# EAGLE design qo-100-i2c-buffer (EAGLE 9.6.2)
CNAME: None; CREVISION: 1; DESIGNER: Joao Silva

## Sheet 1 of 3: MCU
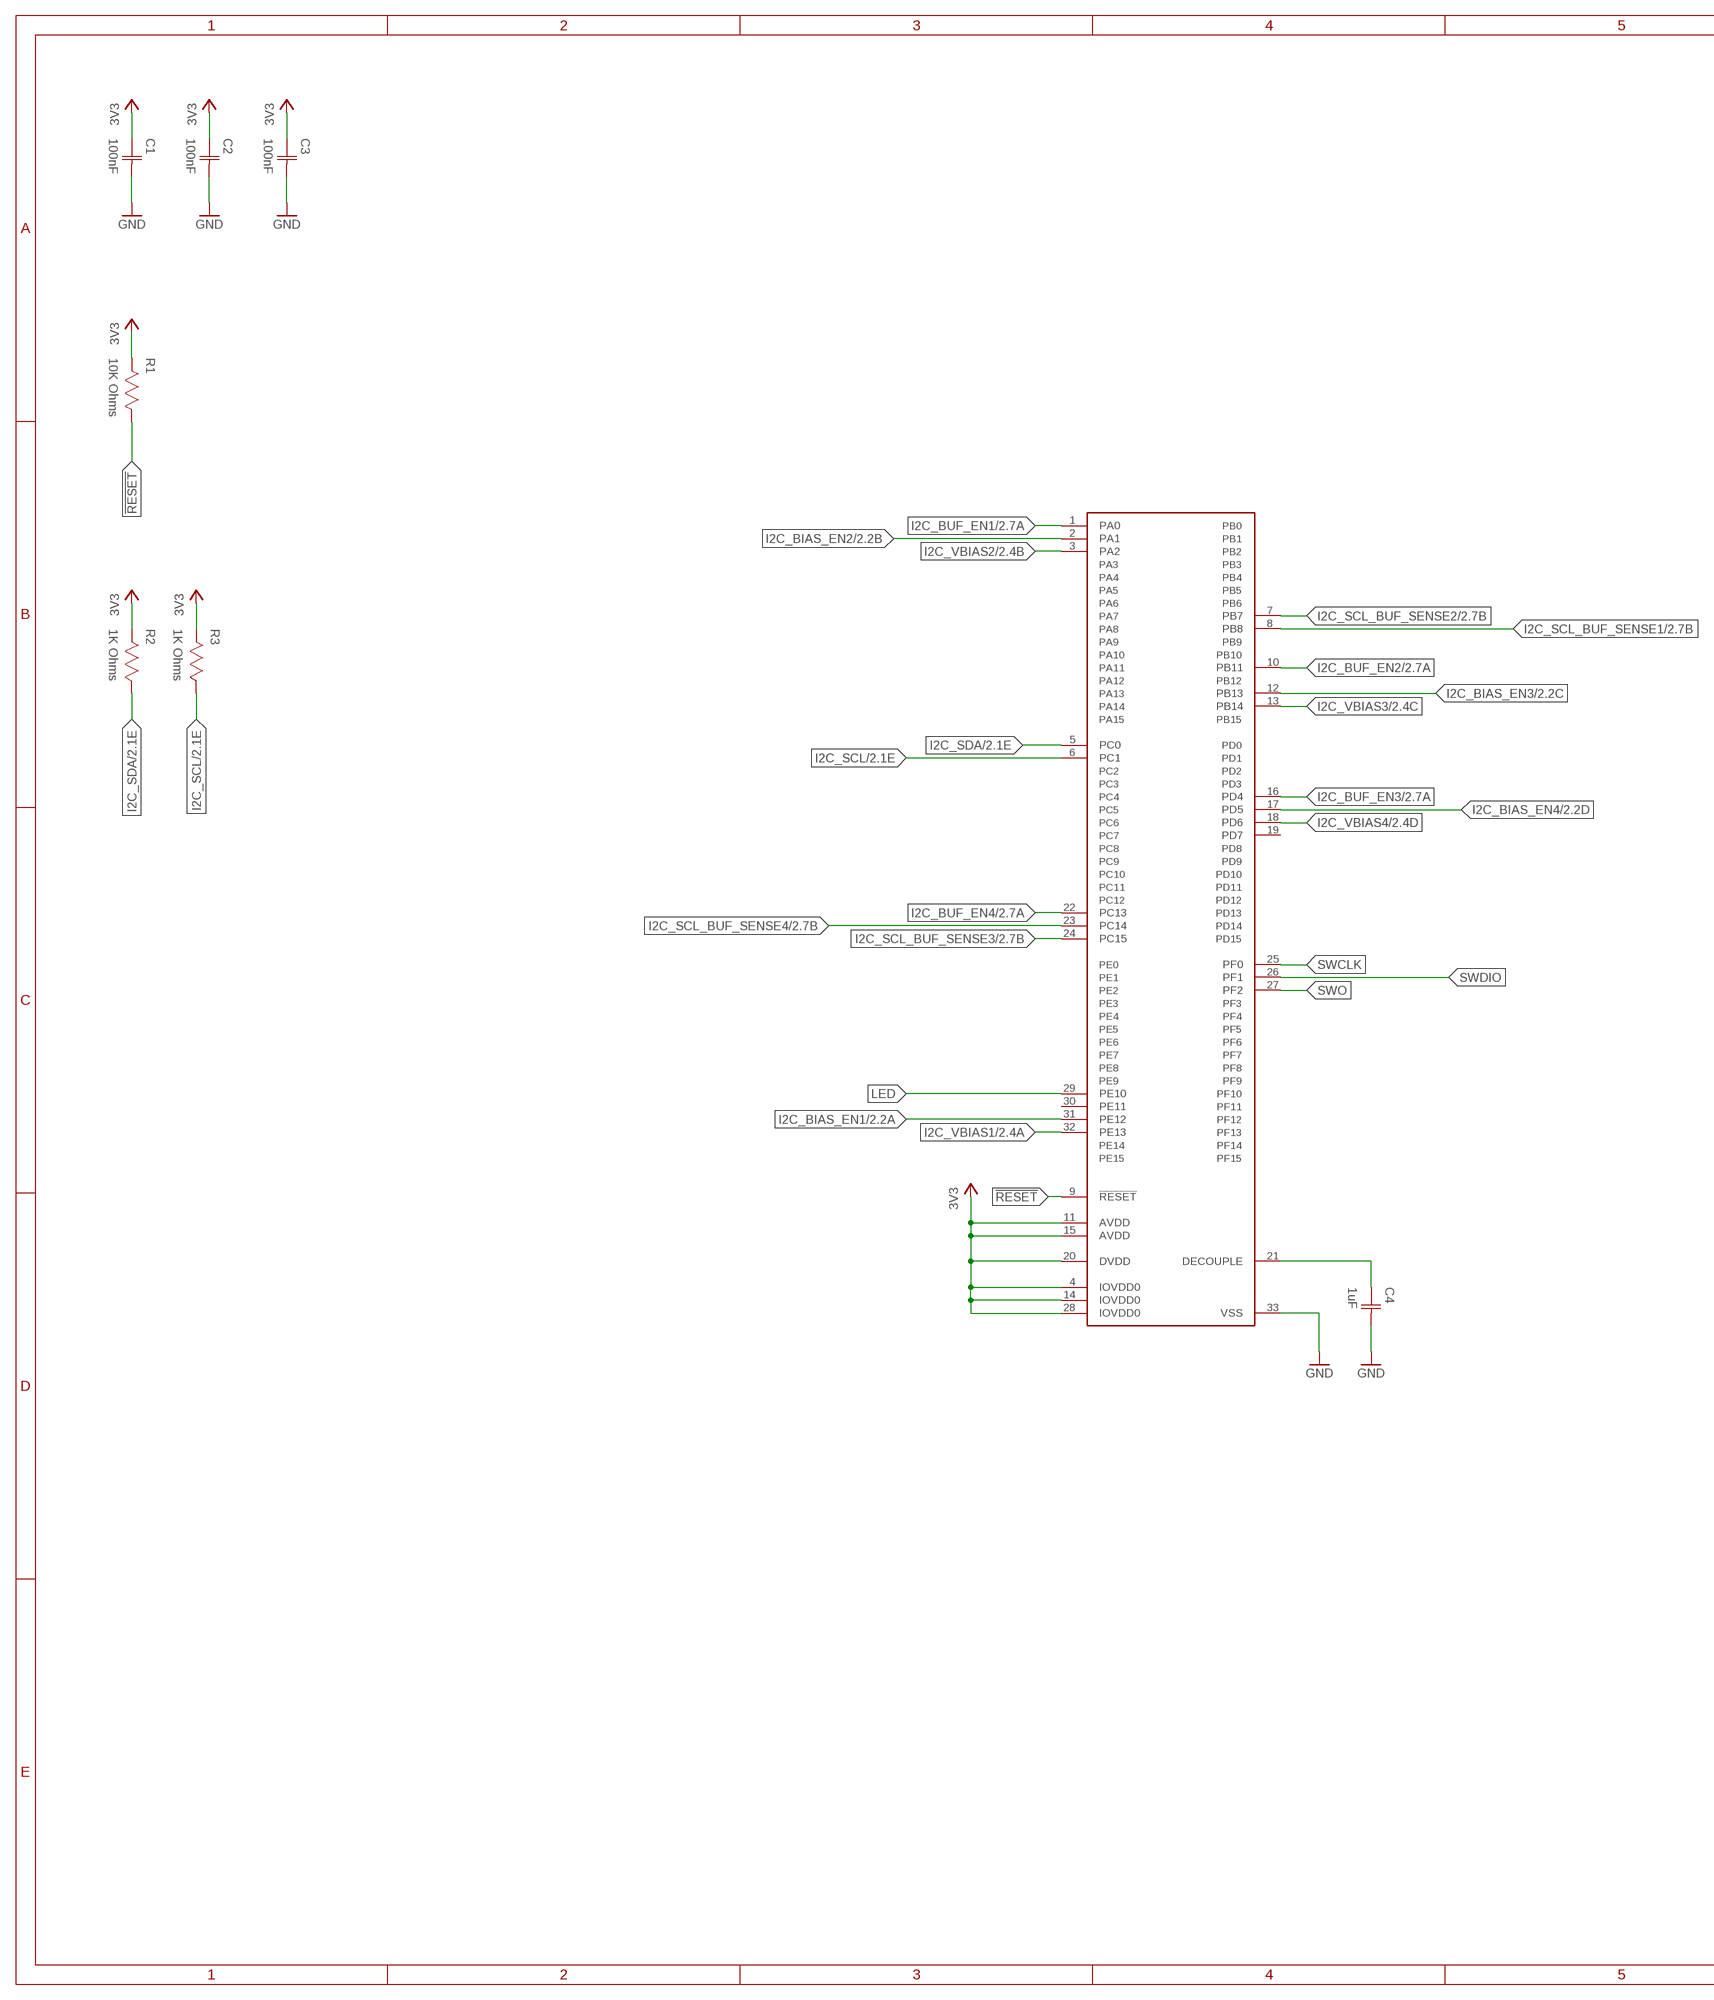
[diagram p0: schematic, sheet 1, part 1 of 2]
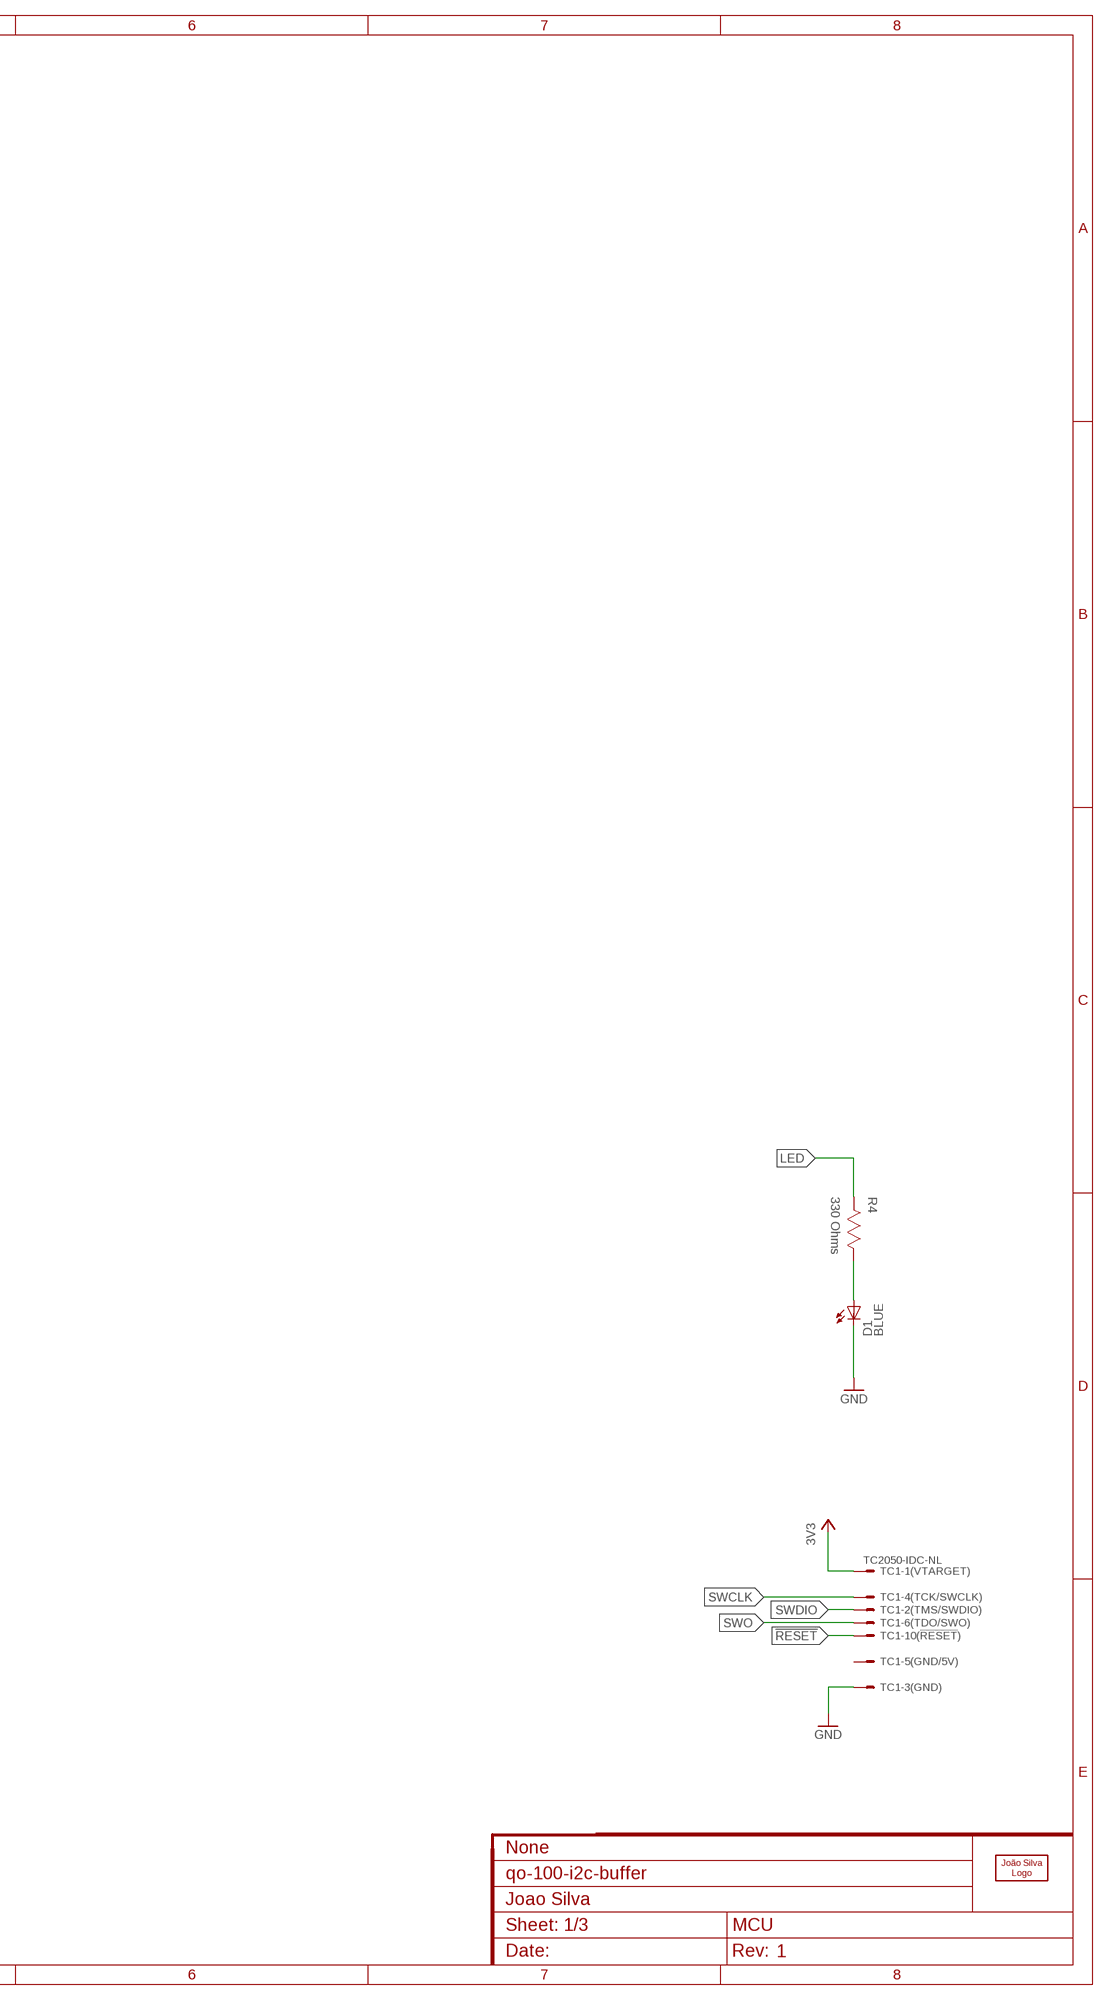
[diagram p1: schematic, sheet 1, part 2 of 2]

### Parts
C1  100nF  CAPACITOR-0402  [CAP0402]
C2  100nF  CAPACITOR-0402  [CAP0402]
C3  100nF  CAPACITOR-0402  [CAP0402]
C4  1uF  CAPACITOR-0402  [CAP0402]
D1  LED0603  [0603]
LOGO1  JS-5MM  [JS_5MM]
R1  10K Ohms  RESISTOR-0402  [RES0402]
R2  1K Ohms  RESISTOR-0402  [RES0402]
R3  1K Ohms  RESISTOR-0402  [RES0402]
R4  330 Ohms  RESISTOR-0402  [RES0402]
TC1  TC2050-IDC-NL  [TC2050-IDC-NL]
U1  EFM32TG11B120F128GM32  [QFN32_0.5P_TG]

### Nets
3V3: C1.1(C1) C2.1(C1) C3.1(C1) R1.2 R2.2 R3.2 TC1.1 U1.4(IOVDD0) U1.11(AVDD) U1.14(IOVDD0) U1.15(AVDD) U1.20(DVDD) U1.28(IOVDD0) ; also sheet 2,3
!RESET: R1.1 TC1.10 U1.9(!RESET)
GND: C1.2(C2) C2.2(C2) C3.2(C2) C4.2(C2) D1.C TC1.3 U1.33(VSS) ; also sheet 2,3
I2C_BIAS_EN1: U1.31(PE12) ; also sheet 2
I2C_BIAS_EN2: U1.2(PA1) ; also sheet 2
I2C_BIAS_EN3: U1.12(PB13) ; also sheet 2
I2C_BIAS_EN4: U1.17(PD5) ; also sheet 2
I2C_BUF_EN1: U1.1(PA0) ; also sheet 2
I2C_BUF_EN2: U1.10(PB11) ; also sheet 2
I2C_BUF_EN3: U1.16(PD4) ; also sheet 2
I2C_BUF_EN4: U1.22(PC13) ; also sheet 2
I2C_SCL: R3.1 U1.6(PC1) ; also sheet 2,3
I2C_SCL_BUF_SENSE1: U1.8(PB8) ; also sheet 2
I2C_SCL_BUF_SENSE2: U1.7(PB7) ; also sheet 2
I2C_SCL_BUF_SENSE3: U1.24(PC15) ; also sheet 2
I2C_SCL_BUF_SENSE4: U1.23(PC14) ; also sheet 2
I2C_SDA: R2.1 U1.5(PC0) ; also sheet 2,3
I2C_VBIAS1: U1.32(PE13) ; also sheet 2
I2C_VBIAS2: U1.3(PA2) ; also sheet 2
I2C_VBIAS3: U1.13(PB14) ; also sheet 2
I2C_VBIAS4: U1.18(PD6) ; also sheet 2
LED: R4.2 U1.29(PE10)
N$14: C4.1(C1) U1.21(DECOUPLE)
N$15: D1.A R4.1
SWCLK: TC1.4 U1.25(PF0)
SWDIO: TC1.2 U1.26(PF1)
SWO: TC1.6 U1.27(PF2)
Unconnected: TC1.5 TC1.7 TC1.8 TC1.9 U1.19(PD7) U1.30(PE11)

## Sheet 2 of 3: Isolators
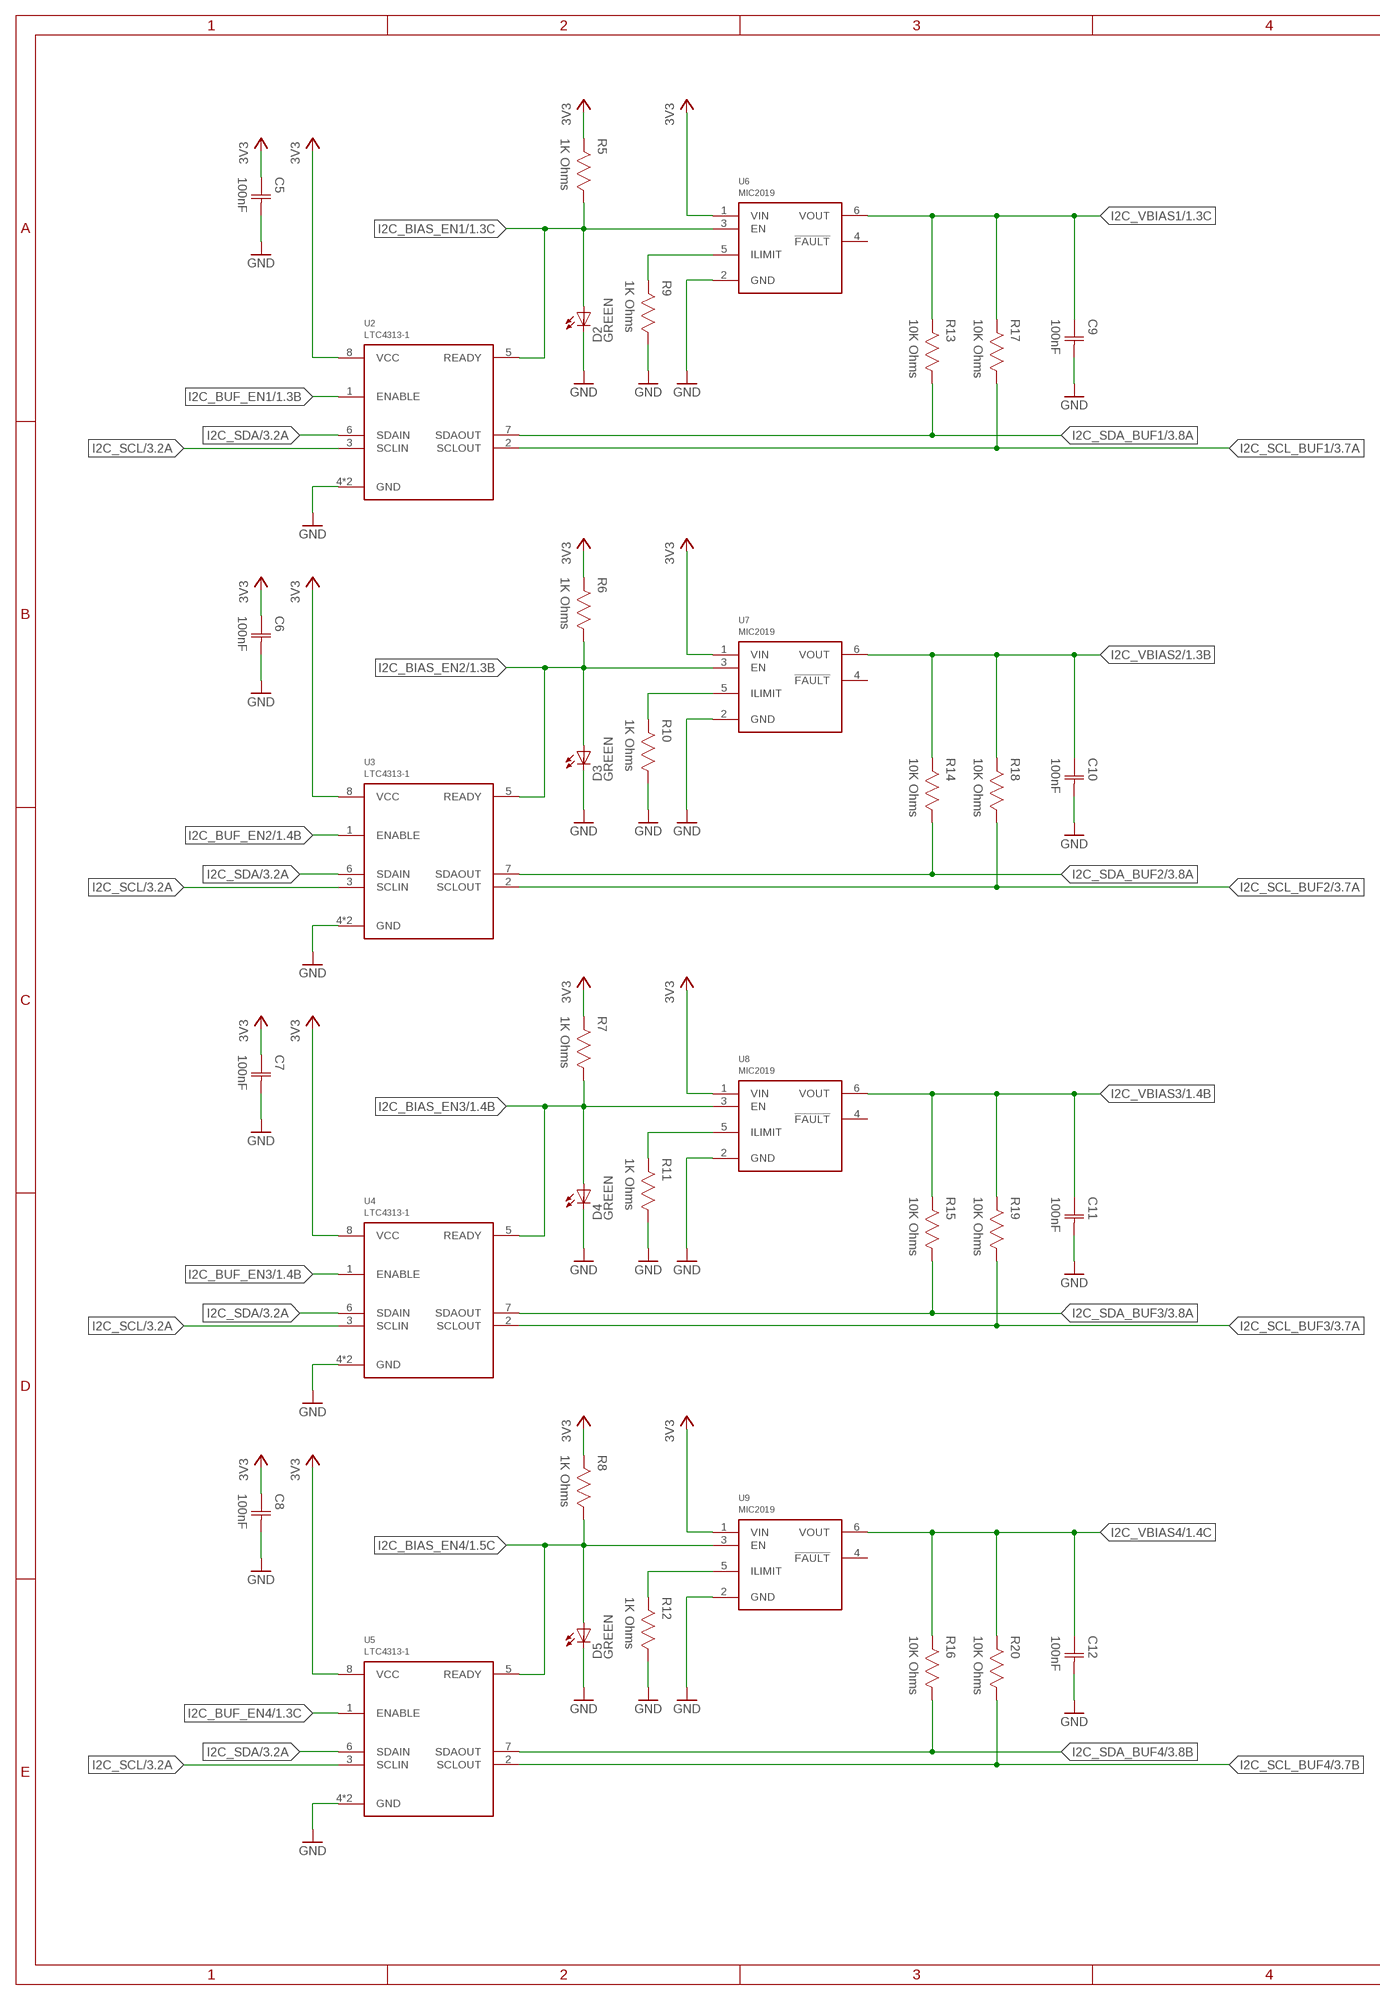
[diagram p2: schematic, sheet 2, part 1 of 2]
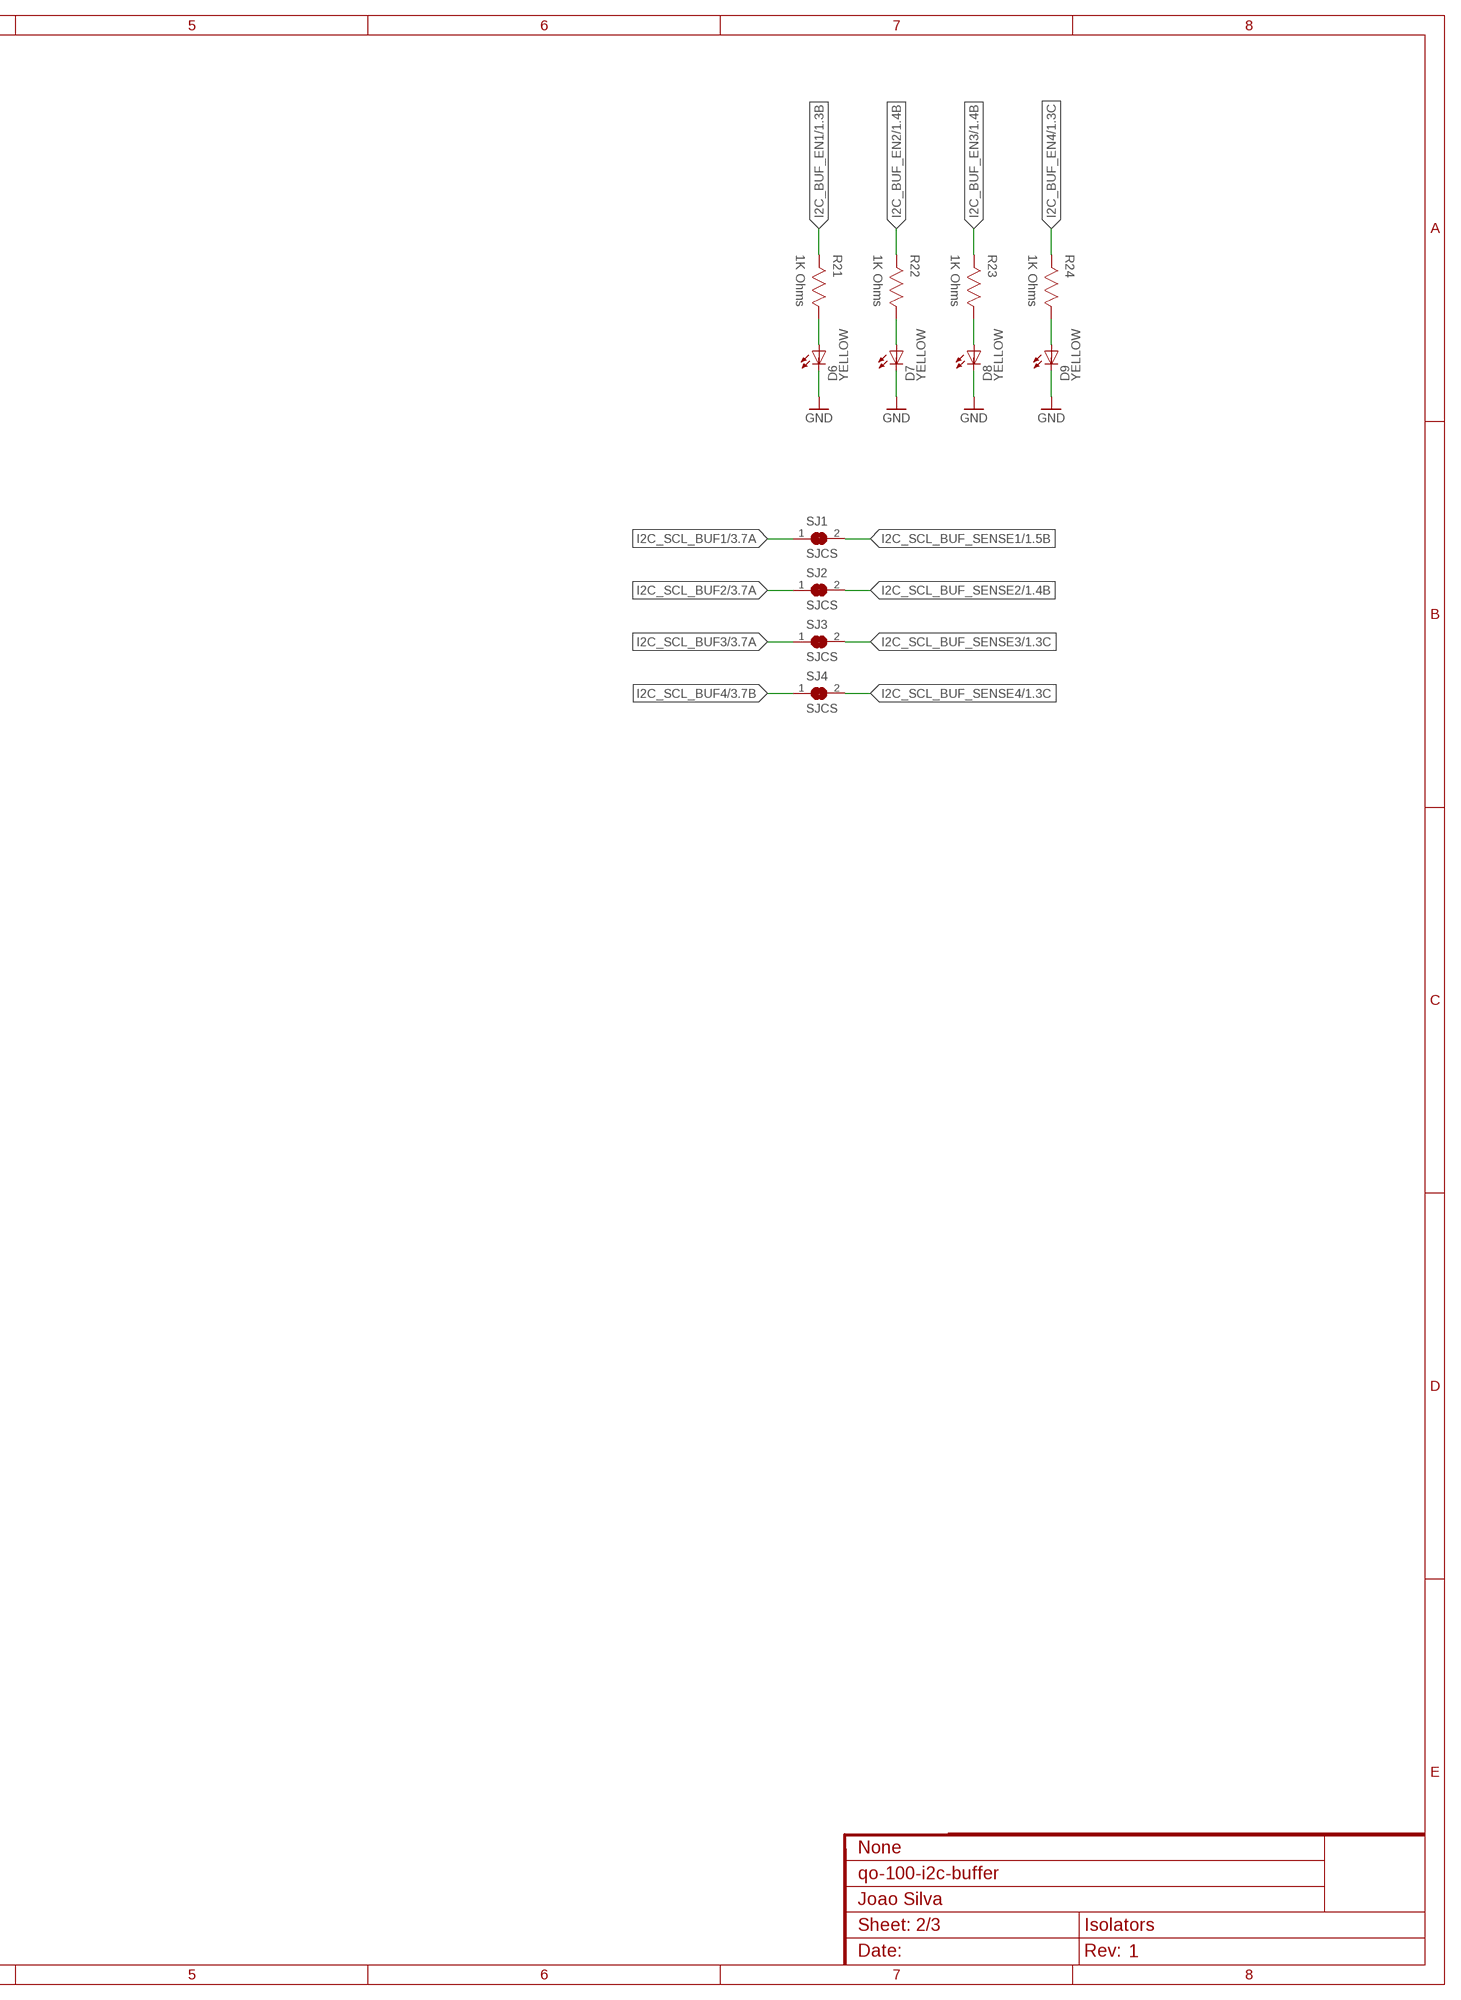
[diagram p3: schematic, sheet 2, part 2 of 2]

### Parts
C5  100nF  CAPACITOR-0402  [CAP0402]
C6  100nF  CAPACITOR-0402  [CAP0402]
C7  100nF  CAPACITOR-0402  [CAP0402]
C8  100nF  CAPACITOR-0402  [CAP0402]
C9  100nF  CAPACITOR-0402  [CAP0402]
C10  100nF  CAPACITOR-0402  [CAP0402]
C11  100nF  CAPACITOR-0402  [CAP0402]
C12  100nF  CAPACITOR-0402  [CAP0402]
D2  LED0603  [0603]
D3  LED0603  [0603]
D4  LED0603  [0603]
D5  LED0603  [0603]
D6  LED0603  [0603]
D7  LED0603  [0603]
D8  LED0603  [0603]
D9  LED0603  [0603]
R5  1K Ohms  RESISTOR-0402  [RES0402]
R6  1K Ohms  RESISTOR-0402  [RES0402]
R7  1K Ohms  RESISTOR-0402  [RES0402]
R8  1K Ohms  RESISTOR-0402  [RES0402]
R9  1K Ohms  RESISTOR-0402  [RES0402]
R10  1K Ohms  RESISTOR-0402  [RES0402]
R11  1K Ohms  RESISTOR-0402  [RES0402]
R12  1K Ohms  RESISTOR-0402  [RES0402]
R13  10K Ohms  RESISTOR-0402  [RES0402]
R14  10K Ohms  RESISTOR-0402  [RES0402]
R15  10K Ohms  RESISTOR-0402  [RES0402]
R16  10K Ohms  RESISTOR-0402  [RES0402]
R17  10K Ohms  RESISTOR-0402  [RES0402]
R18  10K Ohms  RESISTOR-0402  [RES0402]
R19  10K Ohms  RESISTOR-0402  [RES0402]
R20  10K Ohms  RESISTOR-0402  [RES0402]
R21  1K Ohms  RESISTOR-0402  [RES0402]
R22  1K Ohms  RESISTOR-0402  [RES0402]
R23  1K Ohms  RESISTOR-0402  [RES0402]
R24  1K Ohms  RESISTOR-0402  [RES0402]
SJ1  SJCS  [SJC_S]
SJ2  SJCS  [SJC_S]
SJ3  SJCS  [SJC_S]
SJ4  SJCS  [SJC_S]
U2  LTC4313-1  [DFN8]
U3  LTC4313-1  [DFN8]
U4  LTC4313-1  [DFN8]
U5  LTC4313-1  [DFN8]
U6  MIC2019  [SOT23-6]
U7  MIC2019  [SOT23-6]
U8  MIC2019  [SOT23-6]
U9  MIC2019  [SOT23-6]

### Nets
3V3: C5.1(C1) C6.1(C1) C7.1(C1) C8.1(C1) R5.2 R6.2 R7.2 R8.2 U2.8(VCC) U3.8(VCC) U4.8(VCC) U5.8(VCC) U6.1(VIN) U7.1(VIN) U8.1(VIN) U9.1(VIN) ; also sheet 1,3
GND: C5.2(C2) C6.2(C2) C7.2(C2) C8.2(C2) C9.2(C2) C10.2(C2) C11.2(C2) C12.2(C2) D2.C D3.C D4.C D5.C D6.C D7.C D8.C D9.C R9.1 R10.1 R11.1 R12.1 U2.4(GND) U2.9(GND) U3.4(GND) U3.9(GND) U4.4(GND) U4.9(GND) U5.4(GND) U5.9(GND) U6.2(GND) U7.2(GND) U8.2(GND) U9.2(GND) ; also sheet 1,3
I2C_BIAS_EN1: D2.A R5.1 U2.5(READY) U6.3(EN) ; also sheet 1
I2C_BIAS_EN2: D3.A R6.1 U3.5(READY) U7.3(EN) ; also sheet 1
I2C_BIAS_EN3: D4.A R7.1 U4.5(READY) U8.3(EN) ; also sheet 1
I2C_BIAS_EN4: D5.A R8.1 U5.5(READY) U9.3(EN) ; also sheet 1
I2C_BUF_EN1: R21.2 U2.1(ENABLE) ; also sheet 1
I2C_BUF_EN2: R22.2 U3.1(ENABLE) ; also sheet 1
I2C_BUF_EN3: R23.2 U4.1(ENABLE) ; also sheet 1
I2C_BUF_EN4: R24.2 U5.1(ENABLE) ; also sheet 1
I2C_SCL: U2.3(SCLIN) U3.3(SCLIN) U4.3(SCLIN) U5.3(SCLIN) ; also sheet 1,3
I2C_SCL_BUF1: R17.1 SJ1.1 U2.2(SCLOUT) ; also sheet 3
I2C_SCL_BUF2: R18.1 SJ2.1 U3.2(SCLOUT) ; also sheet 3
I2C_SCL_BUF3: R19.1 SJ3.1 U4.2(SCLOUT) ; also sheet 3
I2C_SCL_BUF4: R20.1 SJ4.1 U5.2(SCLOUT) ; also sheet 3
I2C_SCL_BUF_SENSE1: SJ1.2 ; also sheet 1
I2C_SCL_BUF_SENSE2: SJ2.2 ; also sheet 1
I2C_SCL_BUF_SENSE3: SJ3.2 ; also sheet 1
I2C_SCL_BUF_SENSE4: SJ4.2 ; also sheet 1
I2C_SDA: U2.6(SDAIN) U3.6(SDAIN) U4.6(SDAIN) U5.6(SDAIN) ; also sheet 1,3
I2C_SDA_BUF1: R13.1 U2.7(SDAOUT) ; also sheet 3
I2C_SDA_BUF2: R14.1 U3.7(SDAOUT) ; also sheet 3
I2C_SDA_BUF3: R15.1 U4.7(SDAOUT) ; also sheet 3
I2C_SDA_BUF4: R16.1 U5.7(SDAOUT) ; also sheet 3
I2C_VBIAS1: C9.1(C1) R13.2 R17.2 U6.6(VOUT) ; also sheet 1
I2C_VBIAS2: C10.1(C1) R14.2 R18.2 U7.6(VOUT) ; also sheet 1
I2C_VBIAS3: C11.1(C1) R15.2 R19.2 U8.6(VOUT) ; also sheet 1
I2C_VBIAS4: C12.1(C1) R16.2 R20.2 U9.6(VOUT) ; also sheet 1
N$2: R9.2 U6.5(ILIMIT)
N$3: R10.2 U7.5(ILIMIT)
N$4: R11.2 U8.5(ILIMIT)
N$5: R12.2 U9.5(ILIMIT)
N$6: D6.A R21.1
N$7: D7.A R22.1
N$8: D8.A R23.1
N$9: D9.A R24.1
Unconnected: U6.4(!FAULT) U7.4(!FAULT) U8.4(!FAULT) U9.4(!FAULT)

## Sheet 3 of 3: Interface
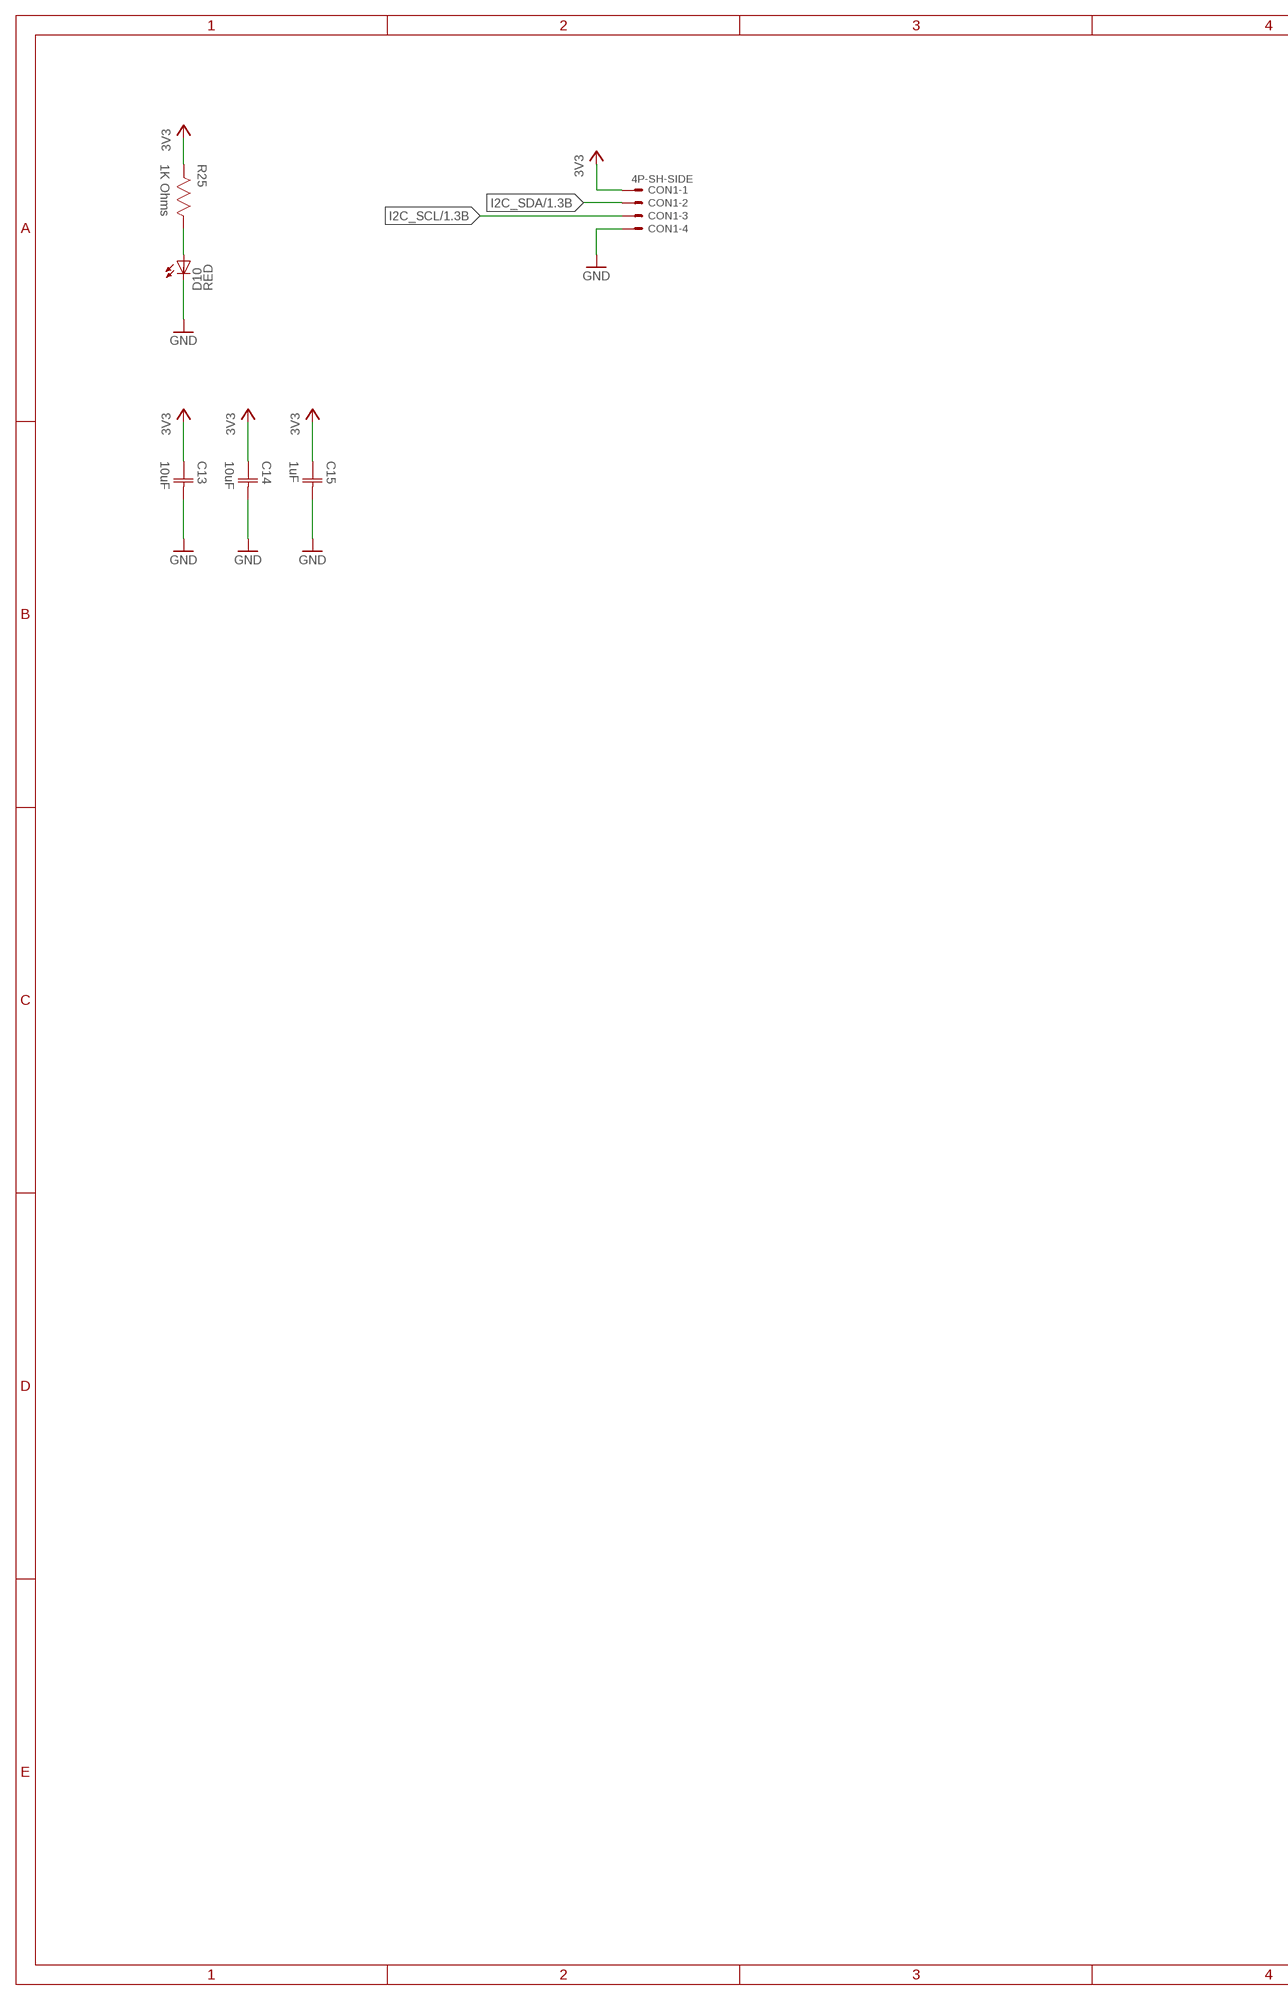
[diagram p4: schematic, sheet 3, part 1 of 2]
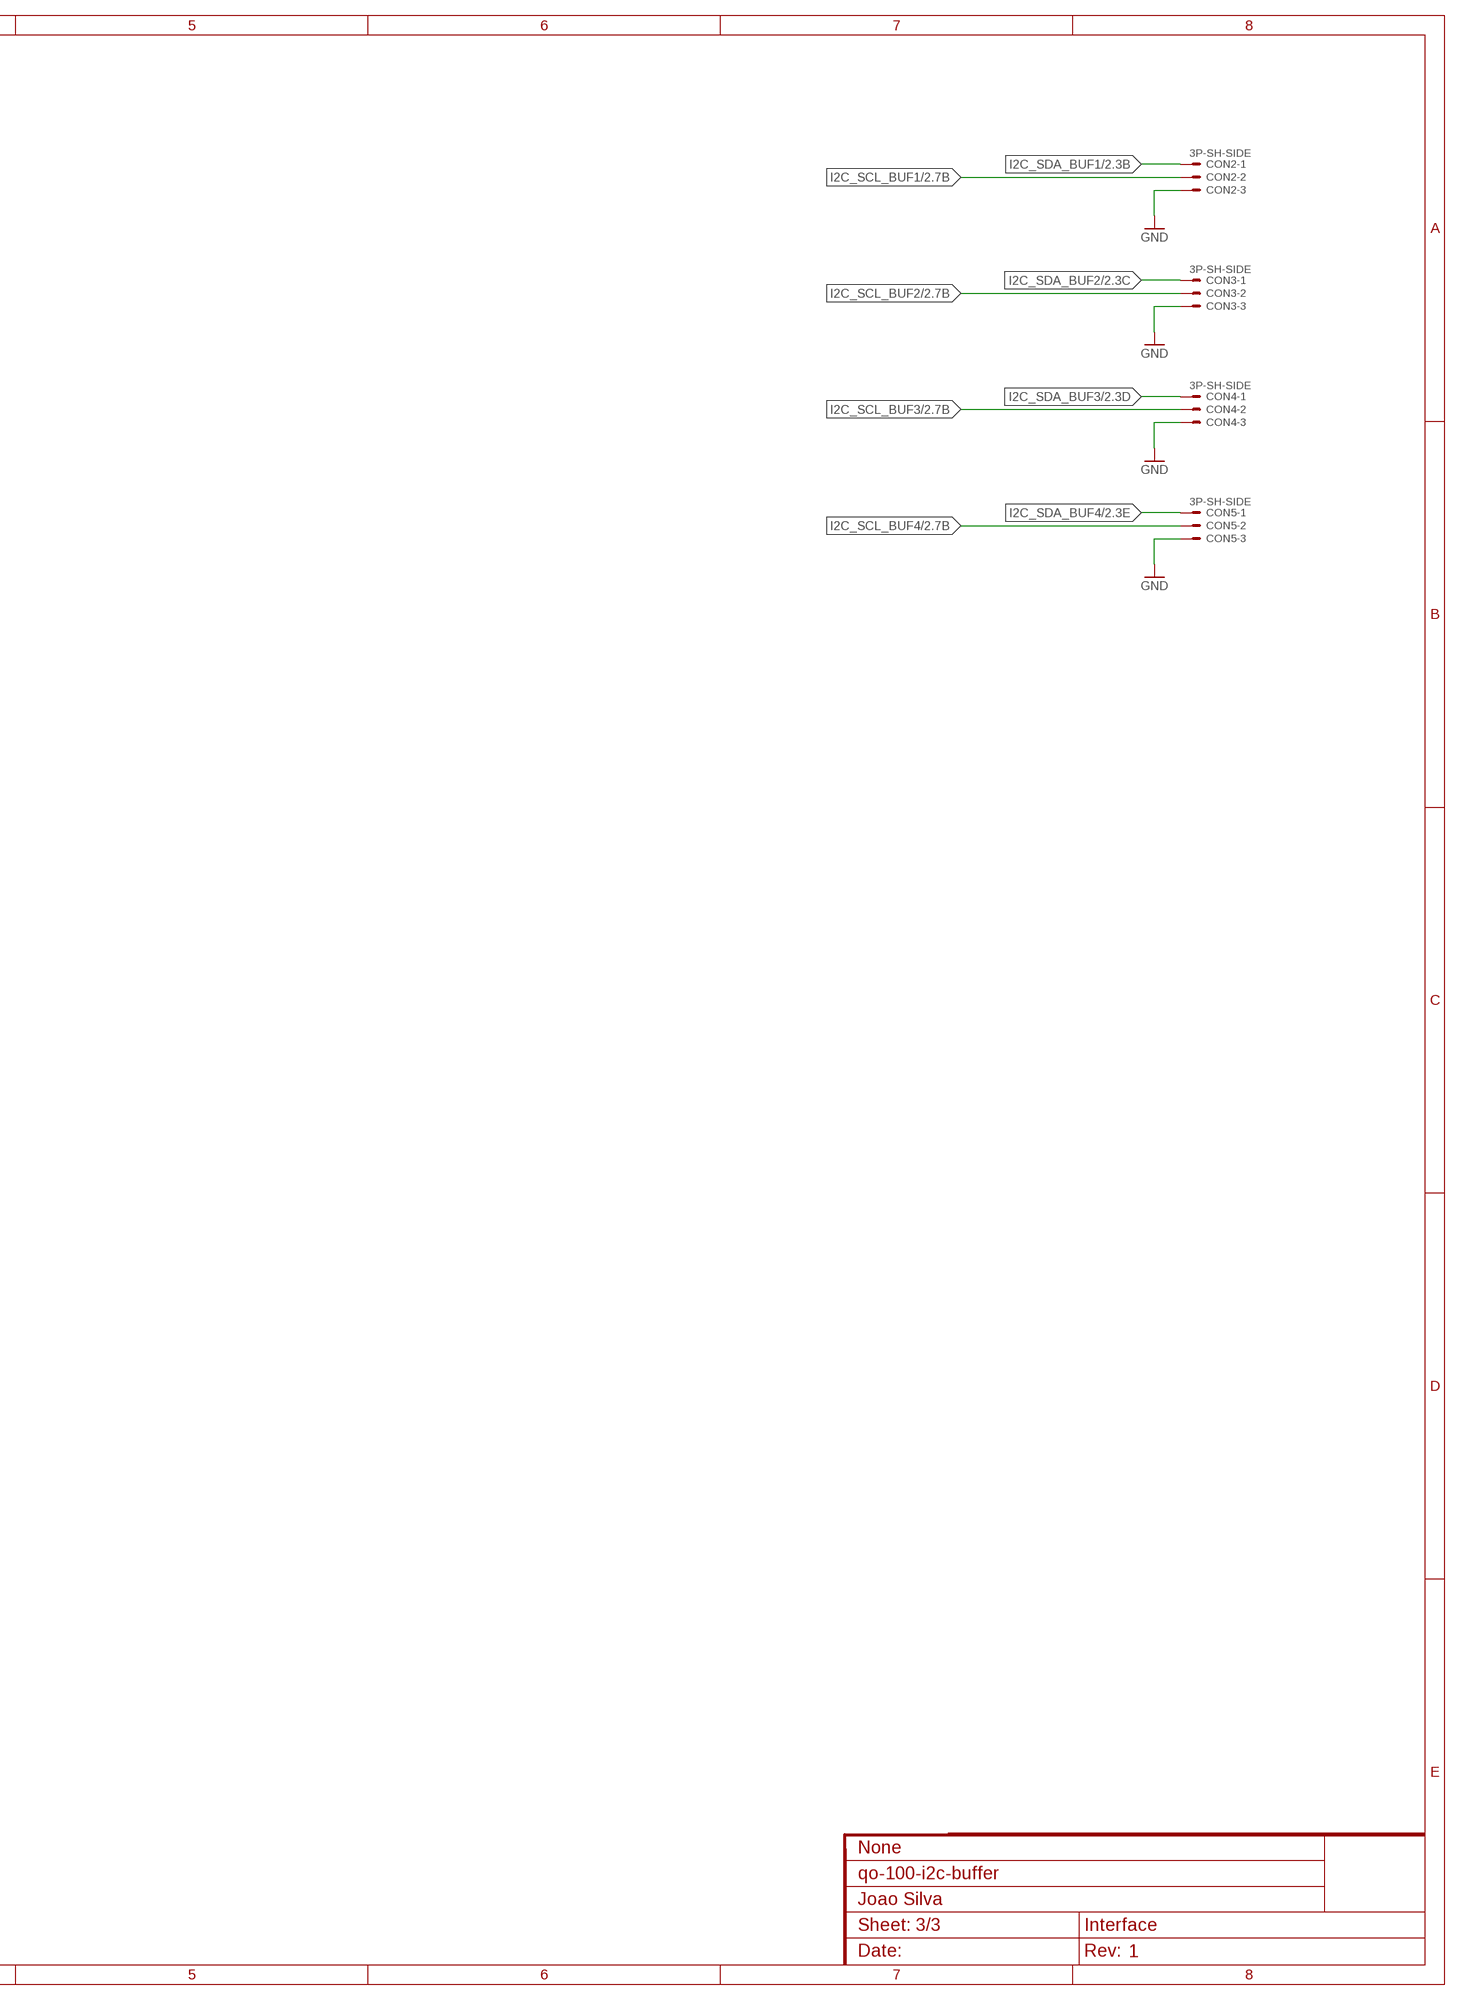
[diagram p5: schematic, sheet 3, part 2 of 2]

### Parts
C13  10uF  CAPACITOR-0603  [CAP0603]
C14  10uF  CAPACITOR-0603  [CAP0603]
C15  1uF  CAPACITOR-0402  [CAP0402]
CON1  4P-SH-SIDE  [SH-04-SIDE]
CON2  3P-SH-SIDE  [SH-03-SIDE]
CON3  3P-SH-SIDE  [SH-03-SIDE]
CON4  3P-SH-SIDE  [SH-03-SIDE]
CON5  3P-SH-SIDE  [SH-03-SIDE]
D10  LED0603  [0603]
R25  1K Ohms  RESISTOR-0402  [RES0402]

### Nets
3V3: C13.1(C1) C14.1(C1) C15.1(C1) CON1.1 R25.2 ; also sheet 1,2
GND: C13.2(C2) C14.2(C2) C15.2(C2) CON1.4 CON2.3 CON3.3 CON4.3 CON5.3 D10.C ; also sheet 1,2
I2C_SCL: CON1.3 ; also sheet 1,2
I2C_SCL_BUF1: CON2.2 ; also sheet 2
I2C_SCL_BUF2: CON3.2 ; also sheet 2
I2C_SCL_BUF3: CON4.2 ; also sheet 2
I2C_SCL_BUF4: CON5.2 ; also sheet 2
I2C_SDA: CON1.2 ; also sheet 1,2
I2C_SDA_BUF1: CON2.1 ; also sheet 2
I2C_SDA_BUF2: CON3.1 ; also sheet 2
I2C_SDA_BUF3: CON4.1 ; also sheet 2
I2C_SDA_BUF4: CON5.1 ; also sheet 2
N$1: D10.A R25.1

## Library data of the parts
C1-C15 = Capacitor:CAPACITOR
CON1 = JST:4P: Disconnectable Crimp style connector, 1.0mm pitch 4 contacts
CON2-CON5 = JST:3P: Disconnectable Crimp style connector, 1.0mm pitch 3 contacts
D1 = LED:LED; COLOR: BLUE
D2-D5 = LED:LED; COLOR: GREEN
D6-D9 = LED:LED; COLOR: YELLOW
D10 = LED:LED; COLOR: RED
LOGO1 = Silkscreen:JS
R1-R25 = Resistor:RESISTOR
SJ1-SJ4 = Solder Jumper:SJC
TC1 = TagConnect:TC2050-IDC
U1 = EFM32:EFM32TG11B1*M32
U2-U5 = Analog Devices:LTC4313-*
U6-U9 = Microchip:MIC20*9

## Board
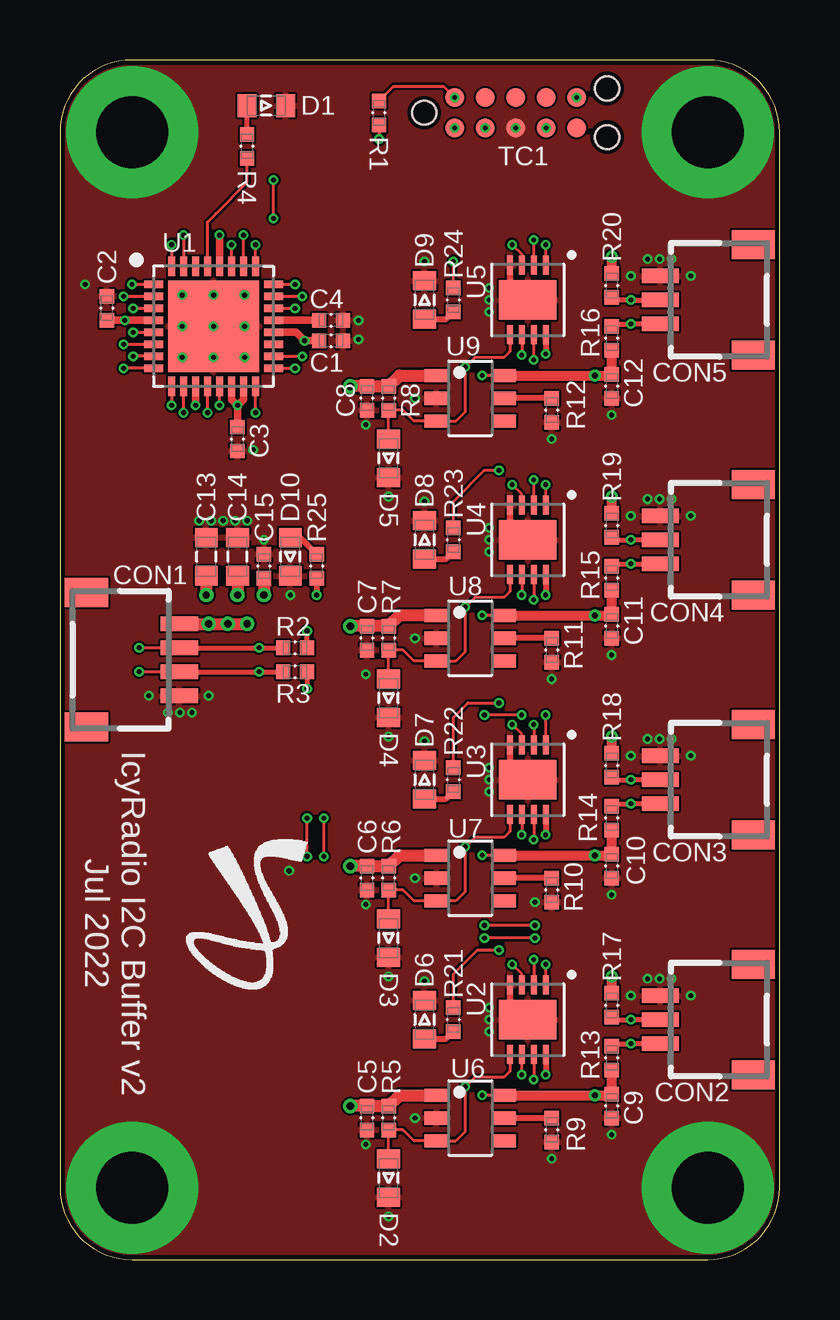
[diagram p6: board, top side]
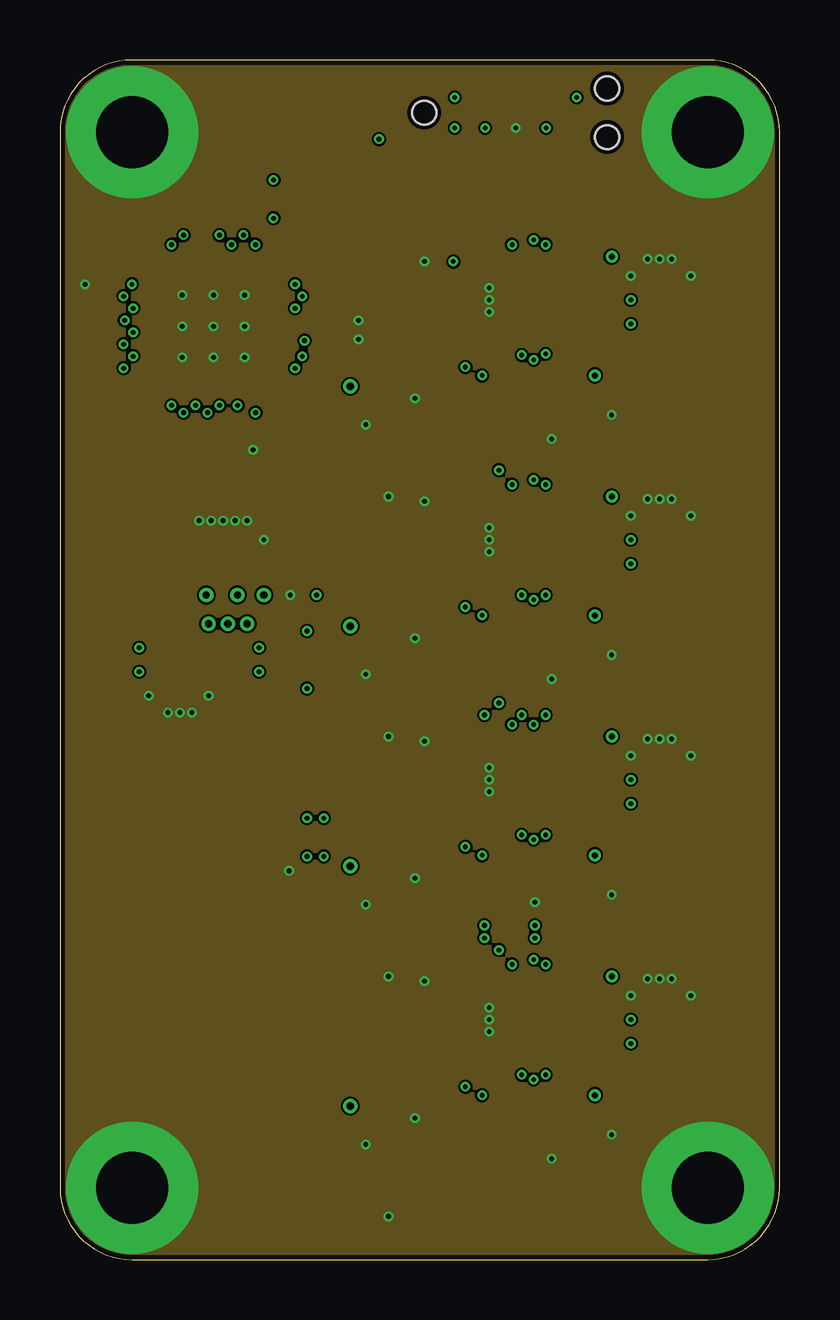
[diagram p7: board, inner layer Route2]
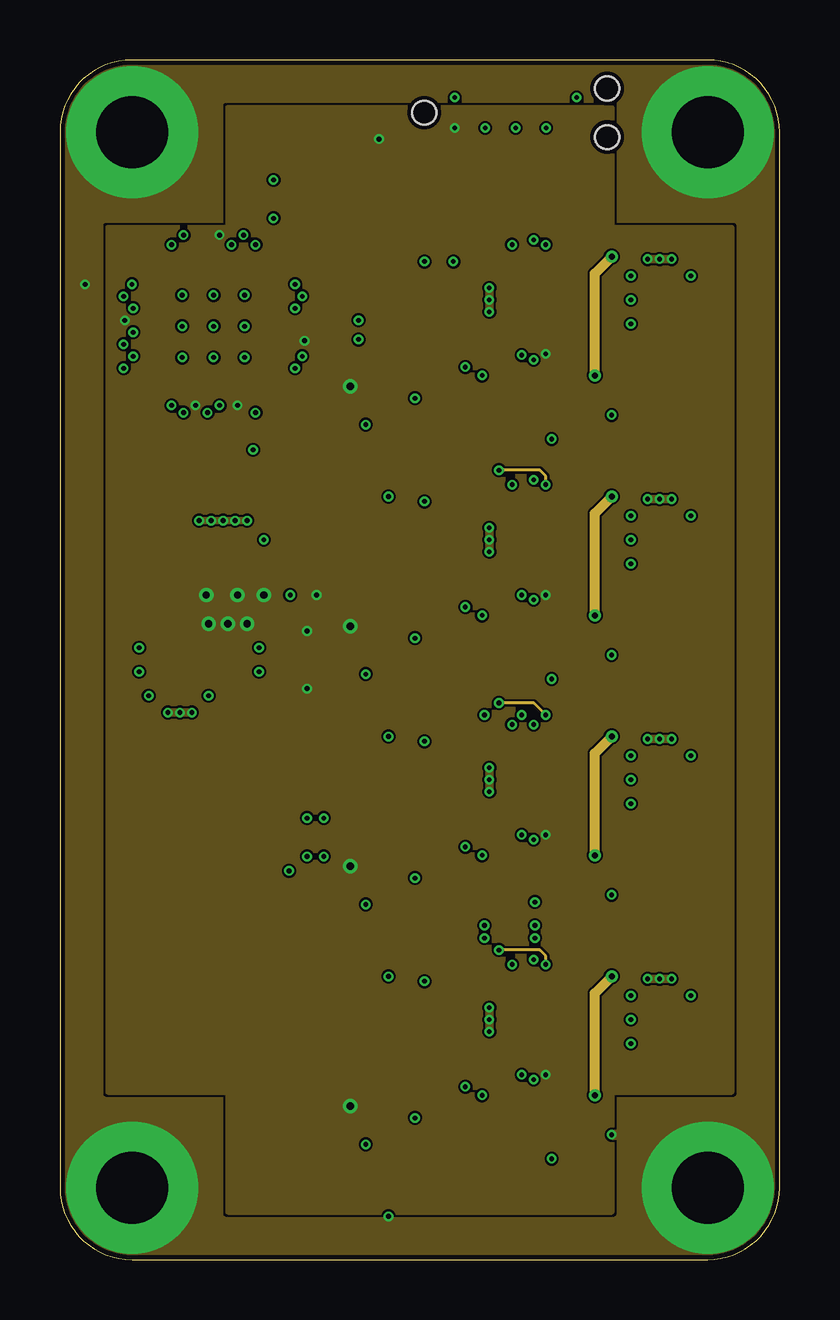
[diagram p8: board, inner layer Route15]
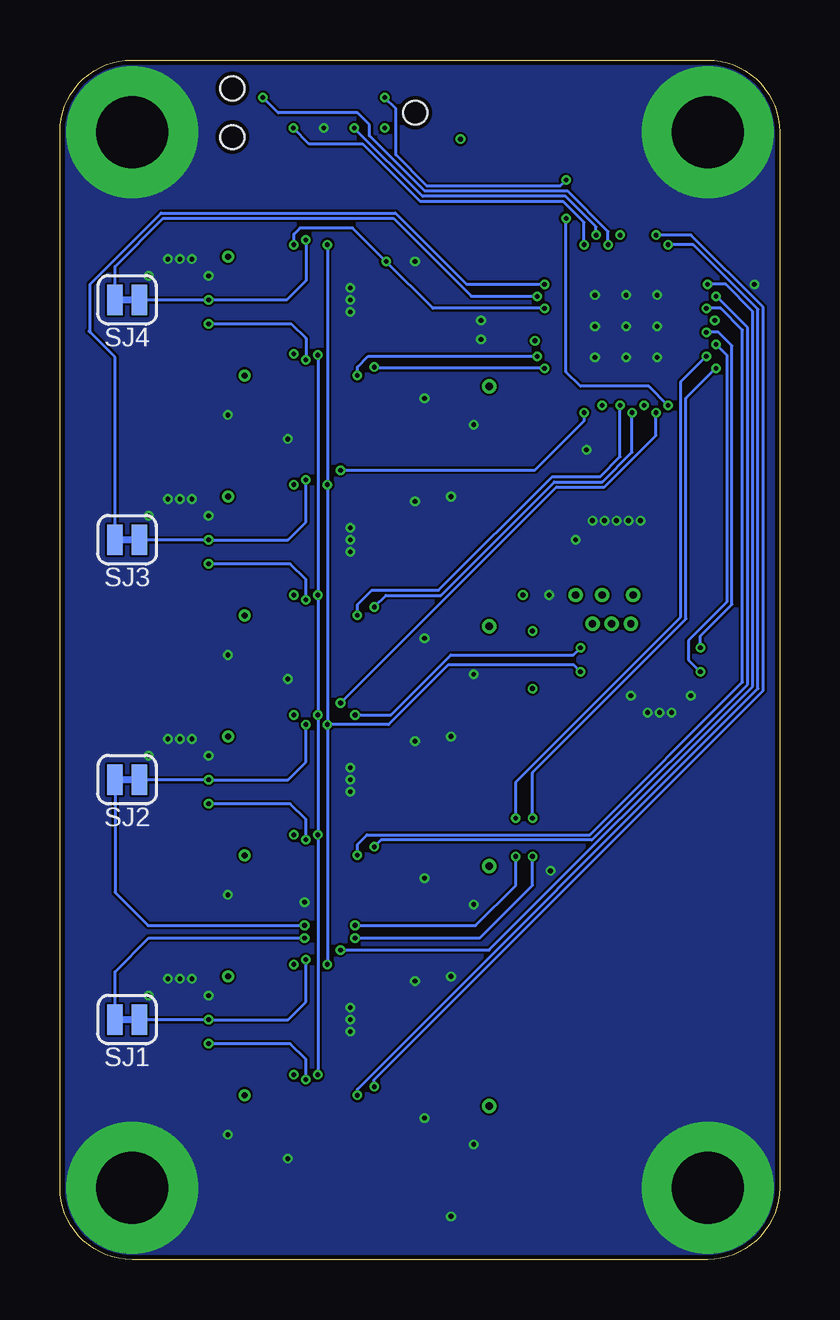
[diagram p9: board, bottom side, seen from below]

Size 30 x 50 mm. Coordinates in mm from the lower left corner, seen from the top.
Outline: 0,47 0,3 arc90 3,0 27,0 arc90 30,3 30,47 arc90 27,50 3,50 arc90 0,47
Copper layers (1+2*15+16): Top 0.035mm / dielectric 0.2mm / Route2 0.0175mm / dielectric 0.665mm / Route15 0.0175mm / dielectric 0.2mm / Bottom 0.035mm
Design rules "jlcpcb_4layer": minimum track width 3.5mil, minimum drill 0.2mm, track to track 3.5mil, track to pad 3.5mil, pad to pad 3.5mil, via to via 5mil, smd to smd 0mil, copper to edge 0.2mm, drill to drill 5mil, minimum pad ring 0.15mm, minimum via ring 0.1mm, stop-mask expansion 0.04mm, vias tented up to drill 10mm, thermal gap 3.5mil

### Footprints (pad centres in the part's own frame; a part is rotated, then mirrored left to right if it is on the bottom)
CAP0402 = smd 0.6 x 0.6: 1 -0.5,0; 2 0.5,0
CAP0603 = smd 0.8 x 0.95: 1 -0.8,0; 2 0.8,0
SH-04-SIDE = smd 0.6 x 1.55: 1 -1.5,2.975; 2 -0.5,2.975; 3 0.5,2.975; 4 1.5,2.975 | smd 1.2 x 1.8: FIT@1 -2.8,-0.9; FIT@2 2.8,-0.9
SH-03-SIDE = smd 0.6 x 1.55: 1 -1,2.975; 2 0,2.975; 3 1,2.975 | smd 1.2 x 1.8: FIT@1 -2.3,-0.9; FIT@2 2.3,-0.9
0603 = smd 0.8 x 0.95: A 0.8,0; C -0.8,0
RES0402 = smd 0.6 x 0.6: 1 -0.5,0; 2 0.5,0
SJC_S = smd 0.635 x 1.27: 1 -0.508,0; 2 0.508,0
TC2050-IDC-NL = smd 0.787 x 0.787: 1 -2.54,-0.635; 2 -1.27,-0.635; 3 0,-0.635; 4 1.27,-0.635; 5 2.54,-0.635; 6 2.54,0.635; 7 1.27,0.635; 8 0,0.635; 9 -1.27,0.635; 10 -2.54,0.635 | hole 0.991: -3.81,0; 3.81,1.016; 3.81,-1.016
QFN32_0.5P_TG = smd 0.8 x 0.3: 1 -2.5,1.75; 2 -2.5,1.25; 3 -2.5,0.75; 4 -2.5,0.25; 5 -2.5,-0.25; 6 -2.5,-0.75; 7 -2.5,-1.25; 8 -2.5,-1.75; 17 2.5,-1.75; 18 2.5,-1.25; 19 2.5,-0.75; 20 2.5,-0.25; 21 2.5,0.25; 22 2.5,0.75; 23 2.5,1.25; 24 2.5,1.75 | smd 0.3 x 0.8: 9 -1.75,-2.5; 10 -1.25,-2.5; 11 -0.75,-2.5; 12 -0.25,-2.5; 13 0.25,-2.5; 14 0.75,-2.5; 15 1.25,-2.5; 16 1.75,-2.5; 25 1.75,2.5; 26 1.25,2.5; 27 0.75,2.5; 28 0.25,2.5; 29 -0.25,2.5; 30 -0.75,2.5; 31 -1.25,2.5; 32 -1.75,2.5 | smd 3.8 x 3.8: 33 0,0
DFN8 = smd 0.8 x 0.25: 1 -1.45,0.75; 2 -1.45,0.25; 3 -1.45,-0.25; 4 -1.45,-0.75; 5 1.45,-0.75; 6 1.45,-0.25; 7 1.45,0.25; 8 1.45,0.75 | smd 1.65 x 2.38: 9 0,0
SOT23-6 = smd 1 x 0.55: 1 -1.4,0.95; 2 -1.4,0; 3 -1.4,-0.95; 4 1.4,-0.95; 5 1.4,0; 6 1.4,0.95

### Placement (x,y rotation side)
C1  11.3,38.3 0 top
C2  1.95,39.65 90 top
C3  7.4,34.2 270 top
C4  11.3,39.15 0 top
C5  12.8,5.9 270 top
C6  12.8,15.9 270 top
C7  12.8,25.9 270 top
C8  12.8,35.9 270 top
C9  23,6.4 270 top
C10  23,16.4 270 top
C11  23,26.4 270 top
C12  23,36.4 270 top
C13  6.1,29.3 90 top
C14  7.4,29.3 90 top
C15  8.5,28.9 90 top
CON1  2,25 270 top
CON2  28,10 90 top
CON3  28,20 90 top
CON4  28,30 90 top
CON5  28,40 90 top
D1  8.6,48.1 180 top
D2  13.7,3.4 90 top
D3  13.7,13.4 90 top
D4  13.7,23.4 90 top
D5  13.7,33.4 90 top
D6  15.2,10 270 top
D7  15.2,20 270 top
D8  15.2,30 270 top
D9  15.2,40 270 top
D10  9.6,29.3 90 top
LOGO1  10.5,17.7 0 top
R1  13.3,47.8 270 top
R2  9.8,25.5 0 top
R3  9.8,24.5 0 top
R4  7.8,46.4 270 top
R5  13.7,5.9 90 top
R6  13.7,15.9 90 top
R7  13.7,25.9 90 top
R8  13.7,35.9 90 top
R9  20.5,5.4 90 top
R10  20.5,15.4 90 top
R11  20.5,25.4 90 top
R12  20.5,35.4 90 top
R13  23,8.4 270 top
R14  23,18.4 270 top
R15  23,28.4 270 top
R16  23,38.4 270 top
R17  23,10.6 90 top
R18  23,20.6 90 top
R19  23,30.6 90 top
R20  23,40.6 90 top
R21  16.4,10 90 top
R22  16.4,20 90 top
R23  16.4,30 90 top
R24  16.4,40 90 top
R25  10.7,28.9 270 top
SJ1  27.2,10 180 bottom
SJ2  27.2,20 180 bottom
SJ3  27.2,30 180 bottom
SJ4  27.2,40 180 bottom
TC1  19,47.8 0 top
U1  6.4,38.9 0 top
U2  19.5,10 270 top
U3  19.5,20 270 top
U4  19.5,30 270 top
U5  19.5,40 270 top
U6  17.1,5.9 0 top
U7  17.1,15.9 0 top
U8  17.1,25.9 0 top
U9  17.1,35.9 0 top

### Tracks (layer width: path | path; a pad name or v marks a point on that pad's centre or on a via)
3V3  (via drill 0.2 pad 0.2, 0.3 pad 0.2)
  Top 0.127: R1.2 v13.3,46.7
  Top 0.2: R2.2 v10.3,26.2 | R3.2 v10.3,23.8
  Top 0.254: R25.2 v10.7,27.7 | U5.8 v20.25,37.75 | U4.8 v20.25,27.7 | U3.8 v20.25,17.7 | U2.8 v20.25,7.7
  Top 0.305: U1.4 v2.7,39.15 C2.1 | U1.14 7.15,35.85 v7.4,35.6 | U1.15 7.65,35.85 v7.4,35.6 | C3.1 v7.4,35.6 | U1.11 v5.65,35.6 | U1.20 9.85,38.65 v10.2,38.3 C1.1 | U1.28 v6.65,42.7
  Top 0.508: CON1.1 v6.2,26.5 v7,26.5 v7.8,26.5 | C13.1 v6.1,27.7 | C14.1 v7.4,27.7 | C15.1 v8.5,27.7 | U8.1 14.15,26.85 R7.2 C7.1 v12.1,26.4 | v12.1,16.4 C6.1 R6.2 14.15,16.85 U7.1 | v12.1,6.4 C5.1 R5.2 14.15,6.85 U6.1 | v12.1,36.4 C8.1 R8.2 14.15,36.85 U9.1
  other vias: 16.46,47.16
  pour Route15 (no thermals): 2,7 7,7 7,2 23,2 23,7 28,7 28,43 23,43 23,48 7,48 7,43 2,43
!RESET  (via drill 0.2 pad 0.2)
  Top 0.127: R1.1 13.9,48.9 15.99,48.9 v16.46,48.44 | U1.9 v4.65,35.6 | v8.9,43.4 v8.9,45
  Bottom 0.127: v4.65,35.6 5.45,36.4 8.3,36.4 8.9,37 v8.9,43.4 | v8.9,45 9.15,44.75 14.7,44.75 16,46.05 16,47.98 v16.46,48.44
GND  (via drill 0.2 pad 0.2, 3 pad 5.5)
  Top 0.254: U2.4 18.75,10.75 U2.9 | U3.4 18.75,20.75 U3.9 | U4.4 18.75,30.75 U4.9 | U5.4 18.75,40.75 U5.9
  other vias: 3,47 27,47 27,3 3,3 9.6,27.7 19,47.16 5.1,40.2 6.4,40.2 7.7,40.2 5.1,37.6 6.4,37.6 7.7,37.6 5.1,38.9 6.4,38.9 7.7,38.9 6.2,23.5 3.7,23.5 4.5,22.8 5,22.8 5.5,22.8 23.8,41 26.3,41 25.5,41.7 25,41.7 24.5,41.7 23.8,31 26.3,31 25.5,31.7 25,31.7 24.5,31.7 23.8,21 26.3,21 25.5,21.7 25,21.7 24.5,21.7 23.8,11 26.3,11 25.5,11.7 25,11.7 24.5,11.7 17.9,9.5 17.9,10 17.9,10.5 17.9,19.5 17.9,20 17.9,20.5 17.9,29.5 17.9,30 17.9,30.5 17.9,39.5 17.9,40 17.9,40.5 14.8,5.9 14.8,15.9 14.8,25.9 14.8,35.9 20.5,24.2 23,25.2 20.5,34.2 23,35.2 19.8,14.9 23,15.2 20.5,4.2 23,5.2 12.75,34.8 12.75,4.8 12.75,14.8 12.75,24.4 1.05,40.65 8.05,33.75 12.45,38.35 12.45,39.15 8.5,30 7.3,30.8 7.8,30.8 5.8,30.8 6.3,30.8 6.8,30.8 15.2,11.6 13.7,11.8 13.7,1.8 15.2,21.6 13.7,21.8 15.2,31.6 13.7,31.8 15.2,41.6 9.55,16.2
  pour Top (rank 6): -1,51 31,51 31,-1 -1,-1
  pour Bottom (rank 6): -4,54 34,54 34,-4 -4,-4
  pour Route15 (rank 6): -3,53 33,53 33,-3 -3,-3
  pour Route2 (rank 6): -2,52 32,52 32,-2 -2,-2
I2C_BIAS_EN1  (via drill 0.2 pad 0.2)
  Top 0.127: 13.8,5.4 14.3,5.4 14.75,4.95 U6.3 16.5,4.95 16.9,5.35 v16.9,7.2 17.3,7.6 18.5,7.6 18.75,7.85 U2.5 | 13.8,5.4 R5.1 | D2.A 13.7,5.3 13.8,5.4 | v5.15,42.7 U1.31
  Bottom 0.127: v16.9,7.2 16.9,7.5 0.68,23.71 0.68,39.7 3.69,42.7 v5.15,42.7
I2C_BIAS_EN2  (via drill 0.2 pad 0.2)
  Top 0.127: D3.A R6.1 14.3,15.4 14.75,14.95 U7.3 16.5,14.95 16.9,15.35 v16.9,17.2 17.3,17.6 18.5,17.6 18.75,17.85 U3.5 | v2.65,40.15 U1.2
  Bottom 0.127: v16.9,17.2 16.62,17.48 7.83,17.48 1.33,23.98 1.33,38.84 v2.65,40.15
I2C_BIAS_EN3  (via drill 0.2 pad 0.2)
  Top 0.127: D4.A R7.1 14.3,25.4 14.75,24.95 U8.3 16.5,24.95 16.9,25.35 v16.9,27.2 17.3,27.6 18.5,27.6 18.75,27.85 U4.5 | v6.15,35.3 U1.12
  Bottom 0.127: v16.9,27.2 16.42,27.68 14.12,27.68 9.39,32.42 7.39,32.42 6.15,33.66 v6.15,35.3
I2C_BIAS_EN4  (via drill 0.2 pad 0.2)
  Top 0.127: 13.8,35.4 14.3,35.4 14.75,34.95 U9.3 16.5,34.95 16.9,35.35 v16.9,37.2 17.3,37.6 18.5,37.6 18.75,37.85 U5.5 | 13.8,35.4 R8.1 | D5.A 13.7,35.3 13.8,35.4 | U1.17 v9.8,37.15
  Bottom 0.127: v16.9,37.2 16.85,37.15 v9.8,37.15
I2C_BUF_EN1  (via drill 0.2 pad 0.2)
  Top 0.127: U2.1 v20.25,12.3 | v3,40.65 U1.1 | R21.2 16.4,11.9 17.4,12.9 v18.3,12.9
  Route15 0.127: v20.25,12.3 20.25,12.65 20,12.9 v18.3,12.9
  Bottom 0.127: v18.3,12.9 12.11,12.9 1.12,23.89 1.12,39.52 2.25,40.65 v3,40.65
I2C_BUF_EN2  (via drill 0.2 pad 0.2)
  Top 0.127: U3.1 v20.25,22.7 | v5.15,35.3 U1.10 | R22.2 16.4,22.6 17,23.2 v18.3,23.2
  Route15 0.127: v20.25,22.7 19.75,23.2 v18.3,23.2
  Bottom 0.127: v5.15,35.3 5.15,34.35 7.3,32.2 9.3,32.2 v18.3,23.2
I2C_BUF_EN3  (via drill 0.2 pad 0.2)
  Top 0.127: U4.1 v20.25,32.3 | v8.15,35.3 U1.16 | R23.2 16.4,31.6 17.7,32.9 v18.3,32.9
  Route15 0.127: v20.25,32.3 20.25,32.65 20,32.9 v18.3,32.9
  Bottom 0.127: v18.3,32.9 10.2,32.9 8.15,34.95 v8.15,35.3
I2C_BUF_EN4  (via drill 0.2, 0.2 pad 0.2)
  Top 0.127: U5.1 v20.25,42.3 | R24.2 v16.4,41.6 | U1.22 v9.8,39.65
  Bottom 0.127: v20.25,42.3 20.25,42.75 20,43 17.8,43 v16.4,41.6 14.45,39.65 v9.8,39.65
I2C_SCL  (via drill 0.2, 0.2 pad 0.2)
  Top 0.127: U2.3 19.25,11.9 v18.85,12.3 | v18.85,42.3 19.25,41.9 U5.3 | U4.3 19.25,31.9 v18.85,32.3 | U3.3 19.25,21.9 v18.85,22.3 | CON1.3 v3.3,24.5 | v2.65,38.15 U1.6
  Top 0.2: CON1.3 v8.3,24.5 R3.1
  Bottom 0.127: v18.85,22.3 v18.85,12.3 | v18.85,22.3 v18.85,32.3 v18.85,42.3 | v8.3,24.5 8.6,24.8 13.8,24.8 16.3,22.3 v18.85,22.3 | v2.65,38.15 2.2,37.7 2.2,27.4 3.8,25.8 3.8,25 v3.3,24.5
I2C_SCL_BUF1  (via drill 0.2 pad 0.2)
  Top 0.127: v19.75,12.5 U2.2
  Top 0.2: CON2.2 v23.8,10 23.1,10 R17.1
  Bottom 0.127: v19.75,12.5 19.75,10.75 20.5,10 v23.8,10 SJ1.1
I2C_SCL_BUF2  (via drill 0.2 pad 0.2)
  Top 0.127: v19.75,22.3 U3.2
  Top 0.2: CON3.2 v23.8,20 23.1,20 R18.1
  Bottom 0.127: v19.75,22.3 19.75,20.75 20.5,20 v23.8,20 SJ2.1
I2C_SCL_BUF3  (via drill 0.2 pad 0.2)
  Top 0.127: U4.2 v19.75,32.5
  Top 0.2: CON4.2 v23.8,30 23.1,30 R19.1
  Bottom 0.127: v19.75,32.5 19.75,30.75 20.5,30 v23.8,30 SJ3.1
I2C_SCL_BUF4  (via drill 0.2)
  Top 0.127: U5.2 v19.75,42.5
  Top 0.2: CON5.2 v23.8,40 23.1,40 R20.1
  Bottom 0.127: v19.75,42.5 19.75,40.8 20.55,40 v23.8,40 SJ4.1
I2C_SCL_BUF_SENSE1  (via drill 0.2)
  Top 0.127: v19.8,13.4 v17.7,13.4 | v10.3,16.8 v10.3,18.4 | U1.8 v2.65,37.15
  Bottom 0.127: SJ1.2 27.71,11.99 26.3,13.4 v19.8,13.4 | v17.7,13.4 12.5,13.4 10.3,15.6 v10.3,16.8 | v10.3,18.4 10.3,20.3 3.9,26.7 3.9,35.9 v2.65,37.15
I2C_SCL_BUF_SENSE2  (via drill 0.2)
  Top 0.127: v19.8,13.93 v17.7,13.93 | v11,16.8 v11,18.4 | U1.7 v3.05,37.65
  Bottom 0.127: SJ2.2 27.71,15.31 26.33,13.93 v19.8,13.93 | v17.7,13.93 12.67,13.93 11,15.6 v11,16.8 | v11,18.4 11,19.91 4.12,26.79 4.12,36.58 v3.05,37.65
I2C_SCL_BUF_SENSE3  (via drill 0.2)
  Top 0.127: U1.24 v9.8,40.65
  Bottom 0.127: SJ3.2 27.71,37.61 28.75,38.65 | 28.75,38.65 28.8,38.7 | 28.75,38.65 28.75,40.66 25.79,43.62 16.01,43.62 13.04,40.65 v9.8,40.65
I2C_SCL_BUF_SENSE4  (via drill 0.2)
  Top 0.127: U1.23 v10.1,40.15
  Bottom 0.127: SJ4.2 27.71,41.39 25.7,43.4 16.1,43.4 12.85,40.15 v10.1,40.15
I2C_SDA  (via drill 0.2, 0.2 pad 0.2)
  Top 0.127: U5.6 v19.25,37.7 | v19.25,7.7 U2.6 | U4.6 v19.25,27.7 | U3.6 v19.25,17.7 | v19.25,22.7 v17.7,22.7 | CON1.2 v3.3,25.5 | v3.05,38.65 U1.5
  Top 0.2: CON1.2 v8.3,25.5 R2.1
  Bottom 0.127: v19.25,37.7 v19.25,27.7 v19.25,22.7 v19.25,17.7 v19.25,7.7 | v17.7,22.7 16.2,22.7 13.71,25.2 8.6,25.2 v8.3,25.5 | v3.3,25.5 3.3,26 1.98,27.31 1.98,38.08 2.55,38.65 v3.05,38.65
I2C_SDA_BUF1  (via drill 0.2 pad 0.2)
  Top 0.127: U2.7 v19.75,7.5
  Top 0.2: CON2.1 v23.8,9 23.1,9 R13.1
  Bottom 0.127: v19.75,7.5 19.75,8.35 20.4,9 v23.8,9
I2C_SDA_BUF2  (via drill 0.2 pad 0.2)
  Top 0.127: U3.7 v19.75,17.5
  Top 0.2: CON3.1 v23.8,19 23.1,19 R14.1
  Bottom 0.127: v19.75,17.5 19.75,18.35 20.4,19 v23.8,19
I2C_SDA_BUF3  (via drill 0.2 pad 0.2)
  Top 0.127: U4.7 v19.75,27.5
  Top 0.2: R15.1 23.1,29 v23.8,29 CON4.1
  Bottom 0.127: v19.75,27.5 19.75,28.35 20.4,29 v23.8,29
I2C_SDA_BUF4  (via drill 0.2)
  Top 0.127: v19.75,37.5 U5.7
  Top 0.2: CON5.1 v23.8,39 23.1,39 R16.1
  Bottom 0.127: v23.8,39 20.35,39 19.75,38.4 v19.75,37.5
I2C_VBIAS1  (via drill 0.2 pad 0.2, 0.25 pad 0.2)
  Top 0.127: U6.6 v17.6,6.85 | v4.65,42.3 U1.32
  Top 0.406: U6.6 v22.3,6.85 22.95,6.85 C9.1 R13.2 | R17.2 v23,11.8
  Route15 0.406: v22.3,6.85 22.3,11.1 v23,11.8
  Bottom 0.127: v17.6,6.85 17.6,7.1 0.9,23.8 0.9,39.6 3.6,42.3 v4.65,42.3
I2C_VBIAS2  (via drill 0.2 pad 0.2, 0.25 pad 0.2)
  Top 0.127: U7.6 v17.6,16.85 | v3.05,39.65 U1.3
  Top 0.406: U7.6 v22.3,16.85 22.95,16.85 C10.1 R14.2 | R18.2 v23,21.8
  Route15 0.406: v22.3,16.85 22.3,21.1 v23,21.8
  Bottom 0.127: v17.6,16.85 17.6,17.3 17.2,17.7 7.92,17.7 1.55,24.07 1.55,38.75 2.45,39.65 v3.05,39.65
I2C_VBIAS3  (via drill 0.2 pad 0.2, 0.25 pad 0.2)
  Top 0.127: U8.6 v17.6,26.85 | v6.65,35.6 U1.13
  Top 0.406: U8.6 v22.3,26.85 22.95,26.85 C11.1 R15.2 | R19.2 v23,31.8
  Route15 0.406: v22.3,26.85 22.3,31.1 v23,31.8
  Bottom 0.127: v17.6,26.85 17.6,27.3 17,27.9 14.21,27.9 9.48,32.63 7.48,32.63 6.65,33.46 v6.65,35.6
I2C_VBIAS4  (via drill 0.2 pad 0.2, 0.25 pad 0.2)
  Top 0.127: U9.6 v17.6,36.85 | U1.18 v10.1,37.65
  Top 0.406: U9.6 v22.3,36.85 22.95,36.85 C12.1 R16.2 | R20.2 v23,41.8
  Route15 0.406: v22.3,36.85 22.3,41.1 v23,41.8
  Bottom 0.127: v17.6,36.85 17.6,37.2 17.15,37.65 v10.1,37.65
LED
  Top 0.127: R4.2 7.8,44.9 6.5,43.6 6.15,43.25 U1.29
N$1
  Top 0.254: R25.1 10,30.1 D10.A
N$2
  Top 0.254: U6.5 R9.2
N$3
  Top 0.254: R10.2 U7.5
N$4
  Top 0.254: R11.2 U8.5
N$5
  Top 0.254: R12.2 U9.5
N$6
  Top 0.254: D6.A 16.1,9.2 R21.1
N$7
  Top 0.254: D7.A 16.1,19.2 R22.1
N$8
  Top 0.254: D8.A 16.1,29.2 R23.1
N$9
  Top 0.254: D9.A 16.1,39.2 R24.1
N$14
  Top 0.305: U1.21 C4.1
N$15
  Top 0.203: R4.1 D1.A
SWCLK  (via drill 0.2 pad 0.2)
  Top 0.127: U1.25 v8.15,42.3
  Bottom 0.127: v8.15,42.3 8.15,43.24 9.01,44.1 14.97,44.1 17.37,46.5 19.61,46.5 TC1.4
  other vias: 20.27,47.16
SWDIO  (via drill 0.2 pad 0.2)
  Top 0.127: U1.26 v7.65,42.7
  Bottom 0.127: 7.65,42.85 v7.65,42.7 7.65,43.05 8.92,44.32 14.88,44.32 TC1.2
  other vias: 17.73,47.16
SWO  (via drill 0.2 pad 0.2)
  Top 0.127: U1.27 v7.15,42.3
  Bottom 0.127: v7.15,42.3 7.15,42.85 8.83,44.53 14.79,44.53 17.1,46.84 17.1,47.3 17.6,47.8 20.91,47.8 v21.54,48.44

### Text on the board
tPlace: IcyRadio I2C Buffer v2 / Jul 2022